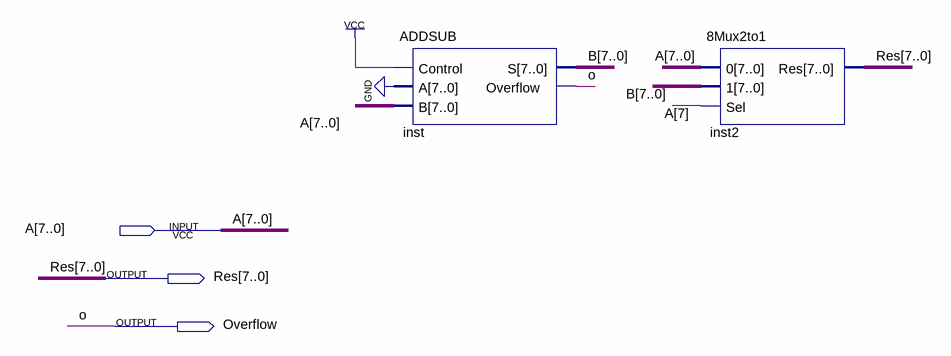
[diagram p0: schematic sheet]
// Quartus schematic TriTuyetDoi.bdf as structural Verilog: 2 symbols, 3 pins
module TriTuyetDoi (
  input  [7:0] A,
  output [7:0] Res,
  output Overflow
);

  wire [7:0] B;

  ADDSUB inst (.Control(1'b1), .A({8{1'b0}}), .B(A), .S(B), .Overflow(Overflow));
  \8Mux2to1  inst2 (.\0 (A), .\1 (B), .Sel(A[7]), .Res(Res));

  // Other names for the same wires on the sheet: o = Overflow
endmodule
